# Altium schematic sheet Motor_Control_PCB_Schematic.SchDoc
size 431 x 279 mm; SheetNumber: 1; SheetTotal: 1; SPICEModelCacheOQDAQLZK: <root> / <DocumentId>OQDAQLZK</DocumentId> / <CacheFrame Number="0"> / <Model Name="irf1010" Kind="CKT"> / <Text>*IRF1010 MCE 4-2-96 / *55V  75A .014 ohm HEXFET pkg:TO-220 2,1,3 / .SUBCKT IRF1010  10 20 40 40 / M1   1  2  3  3  DMOS L=1U W=1U / RD  10  1  5.65M / RS  30  3  1.35M / RG  20  2  12.1 / CGS  2  3  2.15N / EGD 12  0  2  1  1 / VFB 14  0  0 / FFB  2  1  VFB  1 / CGD 13 14  4.49N / R1  13  0  1 / D1  12 13  DLIM / DDG 15 14  DCGD / R2  12 15  1 / D2  15  0  DLIM / DSD  3 10  DSUB / LS  30 40  7.5N / .MODEL DMOS NMOS (LEVEL=3 THETA=60M VMAX=114K ETA=2M VTO=3 KP=19.4) / .MODEL DCGD D (CJO=4.49N VJ=.6 M=.68) / .MODEL DSUB D (IS=311N N=1.5 RS=8.67M BV=55 CJO=4.08N VJ=.8 M=.42 TT=100N) / .MODEL DLIM D (IS=100U) / .ENDS IRF1010</Text> / </Model> / </CacheFrame> / </root>
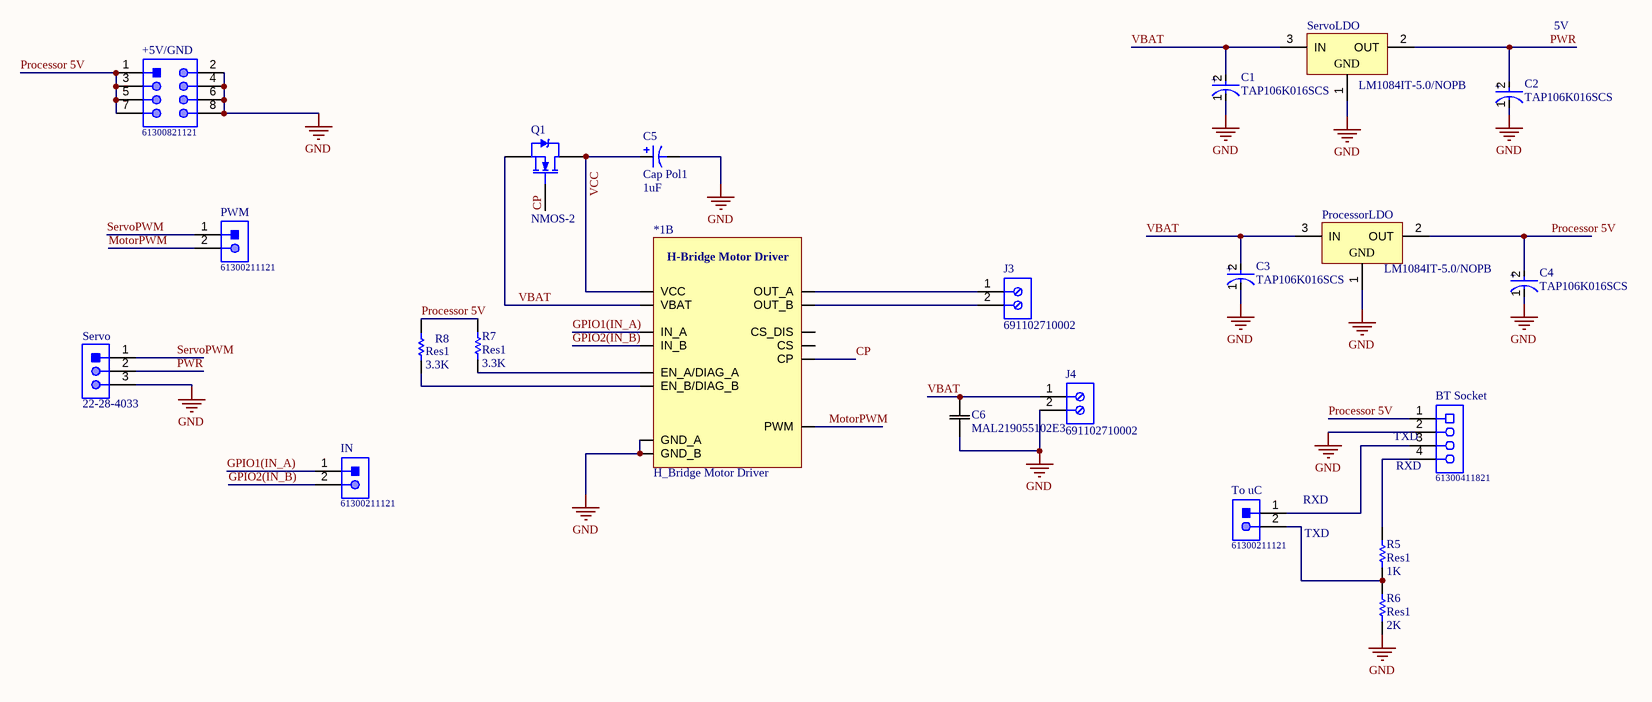
[diagram p0: Motor_Control_PCB_Schematic.SchDoc]

## Parts
*1  H_Bridge Motor Driver  [H-bridge Motor Driver (Lab1)]  (part B of 2)
+5V/GND  61300821121  [61300821121]
BT_Socket  61300411821  [61300411821]
C1  TAP106K016SCS  [FP-TAP106K016SCS-MFG]
C2  TAP106K016SCS  [FP-TAP106K016SCS-MFG]
C3  TAP106K016SCS  [FP-TAP106K016SCS-MFG]
C4  TAP106K016SCS  [FP-TAP106K016SCS-MFG]
C5  Cap Pol1  value 1uF  [RB7.6-15]
C6  MAL219055102E3  [CAP_5102E3_VIS]
IN  61300211121  [61300211121]
J3  691102710002  [691102710002]
J4  691102710002  [691102710002]
ProcessorLDO  LM1084IT-5.0/NOPB  [NDE0003A]
PWM  61300211121  [61300211121]
Q1  NMOS-2  [TO-220AB]
R5  Res1  value 1K  [AXIAL-0.3]
R6  Res1  value 2K  [AXIAL-0.3]
R7  Res1  value 3.3K  [AXIAL-0.3]
R8  Res1  value 3.3K  [AXIAL-0.3]
Servo  22-28-4033  [MOLX-22-28-4033_V]
ServoLDO  LM1084IT-5.0/NOPB  [NDE0003A]
To_uC  61300211121  [61300211121]

## Nets
GND: *1.GND_A *1.GND_B +5V/GND.2 +5V/GND.4 +5V/GND.6 +5V/GND.8 BT_Socket.2 C1.1(C) C2.1(C) C3.1(C) C4.1(C) C5.2 C6.1 J4.2 ProcessorLDO.1(GND) R6.1 Servo.3 ServoLDO.1(GND)
CP: *1.CP Q1.1(G)
GPIO1(IN_A): *1.IN_A IN.1
GPIO2(IN_B): *1.IN_B IN.2
MotorPWM: *1.PWM PWM.2
Processor 5V: +5V/GND.1 +5V/GND.3 +5V/GND.5 +5V/GND.7 BT_Socket.1 C4.2(A) ProcessorLDO.2(OUT) R7.2 R8.2
PWR: C2.2(A) Servo.2 ServoLDO.2(OUT)
ServoPWM: PWM.1 Servo.1
VBAT: *1.VBAT C1.2(A) C3.2(A) C6.2 J4.1 ProcessorLDO.3(IN) Q1.3(S) ServoLDO.3(IN)
VCC: *1.VCC C5.1 Q1.2(D)
Net*1_EN_A/DIAG_A: *1.EN_A/DIAG_A R7.1
Net*1_EN_B/DIAG_B: *1.EN_B/DIAG_B R8.1
Net*1_OUT_A: *1.OUT_A J3.1
Net*1_OUT_B: *1.OUT_B J3.2
NetBT_Socket_3: BT_Socket.3 To_uC.1
NetBT_Socket_4: BT_Socket.4 R5.2
NetR5_1: R5.1 R6.2 To_uC.2

Not connected (* = marked no-connect by the designer): *1 CS CS_DIS

## Notes on the sheet
- 5V
- (near BT_Socket) TXD
- (near BT_Socket) RXD
- (near To_uC) RXD
- TXD
- DWG. NO.
- REV.
- SHT.
- THIS DOCUMENT AND THE DATA DISCLOSED HEREIN OR HEREWITH IS THE PROPERTY OF ALTIUM LIMITED AND MAY BE FREELY DISTRIBUTED IN WHOLE. NO RIGHTS ARE RESERVED OR EXPRESS OR IMPLIED WARANTEE GIVEN.
- REVISION
- DESCRIPTION
- DATE
- APPROVED
- ENG:
- APPROVALS
- PROJECT
- DSN:
- CHK:
- REFERENCE DOCUMENTS
- PROJECT REVISION:
- TITLE
- DOCUMENT REVISION:
- DESIGN ITEM:
- BOM:
- FAB DWG:
- PCB DWG:
- ASSY DWG:
- SCALE:
- SIZE
- B
- CAGE CODE
- FILE NAME
- DWG NO.
- SHEET
- OF
- REV
- (in symbol CMP-04424-000616-1) +
- (in symbol H_Bridge Motor Driver, part B) H-Bridge Motor Driver

## Library data of the parts
*1 = H_Bridge Motor Driver: The VHN5019A-E is a full bridge motor driver / intended for a wide range of automotive / applications
+5V/GND = CMP-1502-01078-1: THT Vertical Pin Header WR-PHD, Pitch 2.54 mm, Dual Row, 8 pins; Manufacturer: Wurth Elektronik; Contact Resistance: 20mOhm; Rated Current: 3A; Working Voltage: 250VAC; Pin Number: 8; Withstanding Voltage: 500VAC; Pitch: 2.54mm; Gender: Male; Datasheet URL: https://katalog.we-online.de/em/datasheet/6130xx21121.pdf; Package Reference: 61300821121; Orientation: Vertical; Part Number: 61300821121; Publisher: WurthElektronik; Mounting Technology: THT; Manufacturer URL: http://www.we-online.de; Packaging: Bag; Row Number: Dual; Operating Temperature: -40to105degC
BT_Socket = CMP-1502-01316-1: THT Vertical Socket Header WR-PHD, Pitch 2.54 mm, Single Row, 4 pins; Manufacturer: Wurth Elektronik; Working Voltage: 250VAC; Rated Current: 3A; Pin Number: 4; Withstanding Voltage: 500VAC; Contact Resistance: 20mOhm; Gender: Female; Pitch: 2.54mm; Datasheet URL: https://katalog.we-online.de/em/datasheet/6130xx11821.pdf; Part Number: 61300411821; Operating Temperature: -40to125degC; Row Number: Single; Package Reference: 61300411821; Orientation: Vertical; Publisher: WurthElektronik; Packaging: Tray; Manufacturer URL: http://www.we-online.de; Mounting Technology: THT
C1-C4 = CMP-04424-000616-1: CAP TANT 10UF 10% 16V RADIAL; Dissipation Factor: 8%; Dielectric Material: Tantalum; Leakage Current: 1.2uA; Polarity: Polar; Life (Hours): 1000Hour; ESR (Equivalent Series Resistance): 3.2R; Lead Diameter: 0.5mm; Packaging: Bulk; Min Operating Temperature: -55°C; RoHS Compliant: Yes; Construction: RADIAL; Length: 9mm; Number of Pins: 2; Height - Seated (Max): 0.354inch; Termination: Radial; Tolerance: 10%; Case/Package: Dipped; Voltage Rating (DC): 16V; Voltage Rating: 16V; Lead Pitch: 2.5mm; Size: 9mm; Voltage: 16V; Lead Free: Lead Free; Mount: Through Hole; Height: 9mm; Max Operating Temperature: 125°C; Features: General Purpose; Diameter: 5mm; Radiation Hardening: No; Package Quantity: 1000; Series: TAP; Capacitance: 10uF
C5 = Cap Pol1: Polarized Capacitor (Radial); Published: 8-Jun-2000; LatestRevisionDate: 17-Jul-2002; LatestRevisionNote: Re-released for DXP Platform.; PackageReference: RB7.6-15; Publisher: Altium Limited; PackageDescription: Polarized Capacitor (Radial); 2 Leads
C6 = MAL219055102E3: No Description Available; Mfr_Name: Vishay; Type: DEV; Copyright: Copyright (C) 2023 Ultra Librarian. All rights reserved.; Manufacturer_Part_Number: MAL219055102E3; RefDes: RefDes
IN PWM To_uC = CMP-1712-00002-4: THT Vertical Pin Header WR-PHD, Pitch 2.54 mm, Single Row, 2 pins; Manufacturer: Wurth Elektronik; Rated Current: 3A; Gender: Male; Withstanding Voltage: 500VAC; Working Voltage: 250VAC; Pitch: 2.54mm; Contact Resistance: 20mOhm; Pin Number: 2; Mounting Technology: THT; Orientation: Vertical; Operating Temperature: -40to105degC; Packaging: Bag; Publisher: WurthElektronik; Datasheet URL: https://katalog.we-online.de/em/datasheet/6130xx11121.pdf; Manufacturer URL: http://www.we-online.de; Row Number: Single; Package Reference: 61300211121; Part Number: 61300211121
J3 J4 = CMP-1502-03258-1: Series 102 - 5.00 mm Horizontal Entry Modular with Pressure Clamp WR-TBL, 2 pin; Manufacturer: Wurth Elektronik; Pin Number: 2; Pitch: 5.00mm; Manufacturer URL: http://www.we-online.de; Mounting Technology: THT; Publisher: WurthElektronik; Packaging: Box; Package Reference: 691102710002; Datasheet URL: http://katalog.we-online.de/em/datasheet/6911027100xx.pdf; Operating Temperature: -40to105degC; Part Number: 691102710002
ProcessorLDO ServoLDO = CMP-0062-02537-3: 5A Low Dropout Positive Regulators, 3-pin TO-220, Pb-Free; Manufacturer: Texas Instruments; PowerWise: N; PackageTopMarking: NSUZXYTTE#*LM1084*IT-5.0; CompType: LDO IC; PackageDescription: TO-220, Molded, 3 Lead, Straight; ComponentLink1URL: http://www.ti.com/general/docs/lit/getliterature.tsp?genericPartNumber=LM1084&fileType=pdf; PackageReference: NDE0003A; RoHS: Y; PinCount: 3; ComponentLink1Description: Datasheet URL
Q1 = NMOS-2: N-Channel Power MOSFET; Note: Pin 2 is electrically connected to pin 4.; Published: 8-Jun-2000; LatestRevisionDate: 17-Jul-2002; LatestRevisionNote: Re-released for DXP Platform.; DatasheetVersion: PD-9.814; PackageVersion: Feb-1997; PackageReference: TO-220AB; Publisher: Altium Limited; PackageDescription: TO, Thru-Hole, Vertical, Heatsink Mounted; 3 In-Line Leads; Pitch 2.54 mm; ComponentLink1Description: Manufacturer Link; ComponentLink1URL: http://www.irf.com/
R5-R8 = Res1: Resistor; Published: 8-Jun-2000; LatestRevisionDate: 17-Jul-2002; LatestRevisionNote: Re-released for DXP Platform.; PackageReference: AXIAL-0.3; Publisher: Altium Limited; PackageDescription: Axial Device, Thru-Hole; 2 Leads; 0.3 in Pin Spacing
Servo = CMP-1676-00001-5: Male Header, Pitch 2.54 mm, 1 x 3 Position, Height 8.38 mm, Tail Length 3.18 mm, RoHS, Bulk; Manufacturer: Molex; Rows: 1; Voltage Rating: 250 V; Current Rating: 4 A; Min Operating Temperature: 0 degC; Lead Pitch: 0.1 inch; Packaging: Bulk; Contact Finish: Gold; RoHSCompliant: true; Contact Material: Brass; PackageReference: 22-28-4033; REACH SVHC: Unknown; PackageDescription: Male Header, Pitch 2.54 mm, 1 x 3 Position, Height 8.38 mm, Tail Length 3.18 mm; ComponentLink2URL: http://www.molex.com/pdm_docs/sd/022284033_sd.pdf; Height: 8.38 mm; Mounting Technology: Through Hole; ComponentLink1Description: Manufacturer URL; Length: 7.62 mm; Mount: Through Hole; DatasheetVersion: Rev. G, 01/2012; Max Operating Temperature: 75 degC; ComponentLink2Description: Datasheet; Colour: Black; Pins: 3; Contact Plating: Gold; Package Quantity: 1; ComponentLink1URL: http://www.molex.com/